# Altium schematic sheet Overview.SchDoc
size A; SheetNumber: 2; SheetTotal: 11
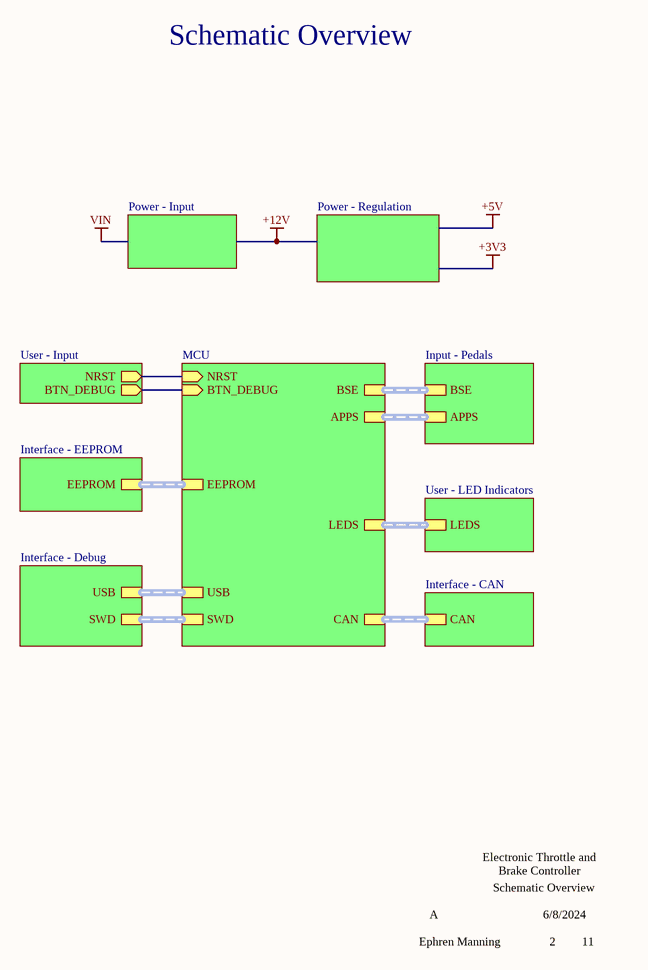
[diagram p0: Overview.SchDoc]

## Sub-sheets
Input - Pedals = Input - Pedals.SchDoc: BSE (harness BSE), APPS (harness APPS)
Interface - CAN = Interface - CAN.SchDoc: CAN (harness CAN)
Interface - Debug = Interface - Debug.SchDoc: SWD (harness SWD), USB (harness USB)
Interface - EEPROM = Interface - EEPROM.SchDoc: EEPROM (harness EEPROM)
MCU = MCU.SchDoc: CAN (harness CAN), SWD (harness SWD), USB (harness USB), LEDS (harness LEDS), EEPROM (harness EEPROM), APPS (harness APPS), BSE (harness BSE), NRST (in), BTN_DEBUG (in)
Power - Input = Power - Input.SchDoc: no entries
Power - Regulation = Power - Regulation.SchDoc: no entries
User - Input = User - Input.SchDoc: NRST (out), BTN_DEBUG (out)
User - LED Indicators = User - LED Indicators.SchDoc: LEDS (harness LEDS)

## Nets
(unnamed): sheet MCU/NRST, sheet User - Input/NRST
(unnamed): sheet MCU/BTN_DEBUG, sheet User - Input/BTN_DEBUG

## Buses and harness runs
harness sheet Input - Pedals/APPS = sheet MCU/APPS
harness sheet Input - Pedals/BSE = sheet MCU/BSE
harness sheet Interface - CAN/CAN = sheet MCU/CAN
harness sheet Interface - Debug/SWD = sheet MCU/SWD
harness sheet Interface - Debug/USB = sheet MCU/USB
harness sheet Interface - EEPROM/EEPROM = sheet MCU/EEPROM
harness sheet MCU/LEDS = sheet User - LED Indicators/LEDS

## Notes on the sheet
- Schematic Overview
- Electronic Throttle and
  Brake Controller
- A
- 6/8/2024
- Ephren Manning
- 2
- 11
- Project Title:
- Sheet Title:
- Revision:
- Date:
- Author:
- Sheet        of